# EAGLE design REG 5V (EAGLE 9.6.2)
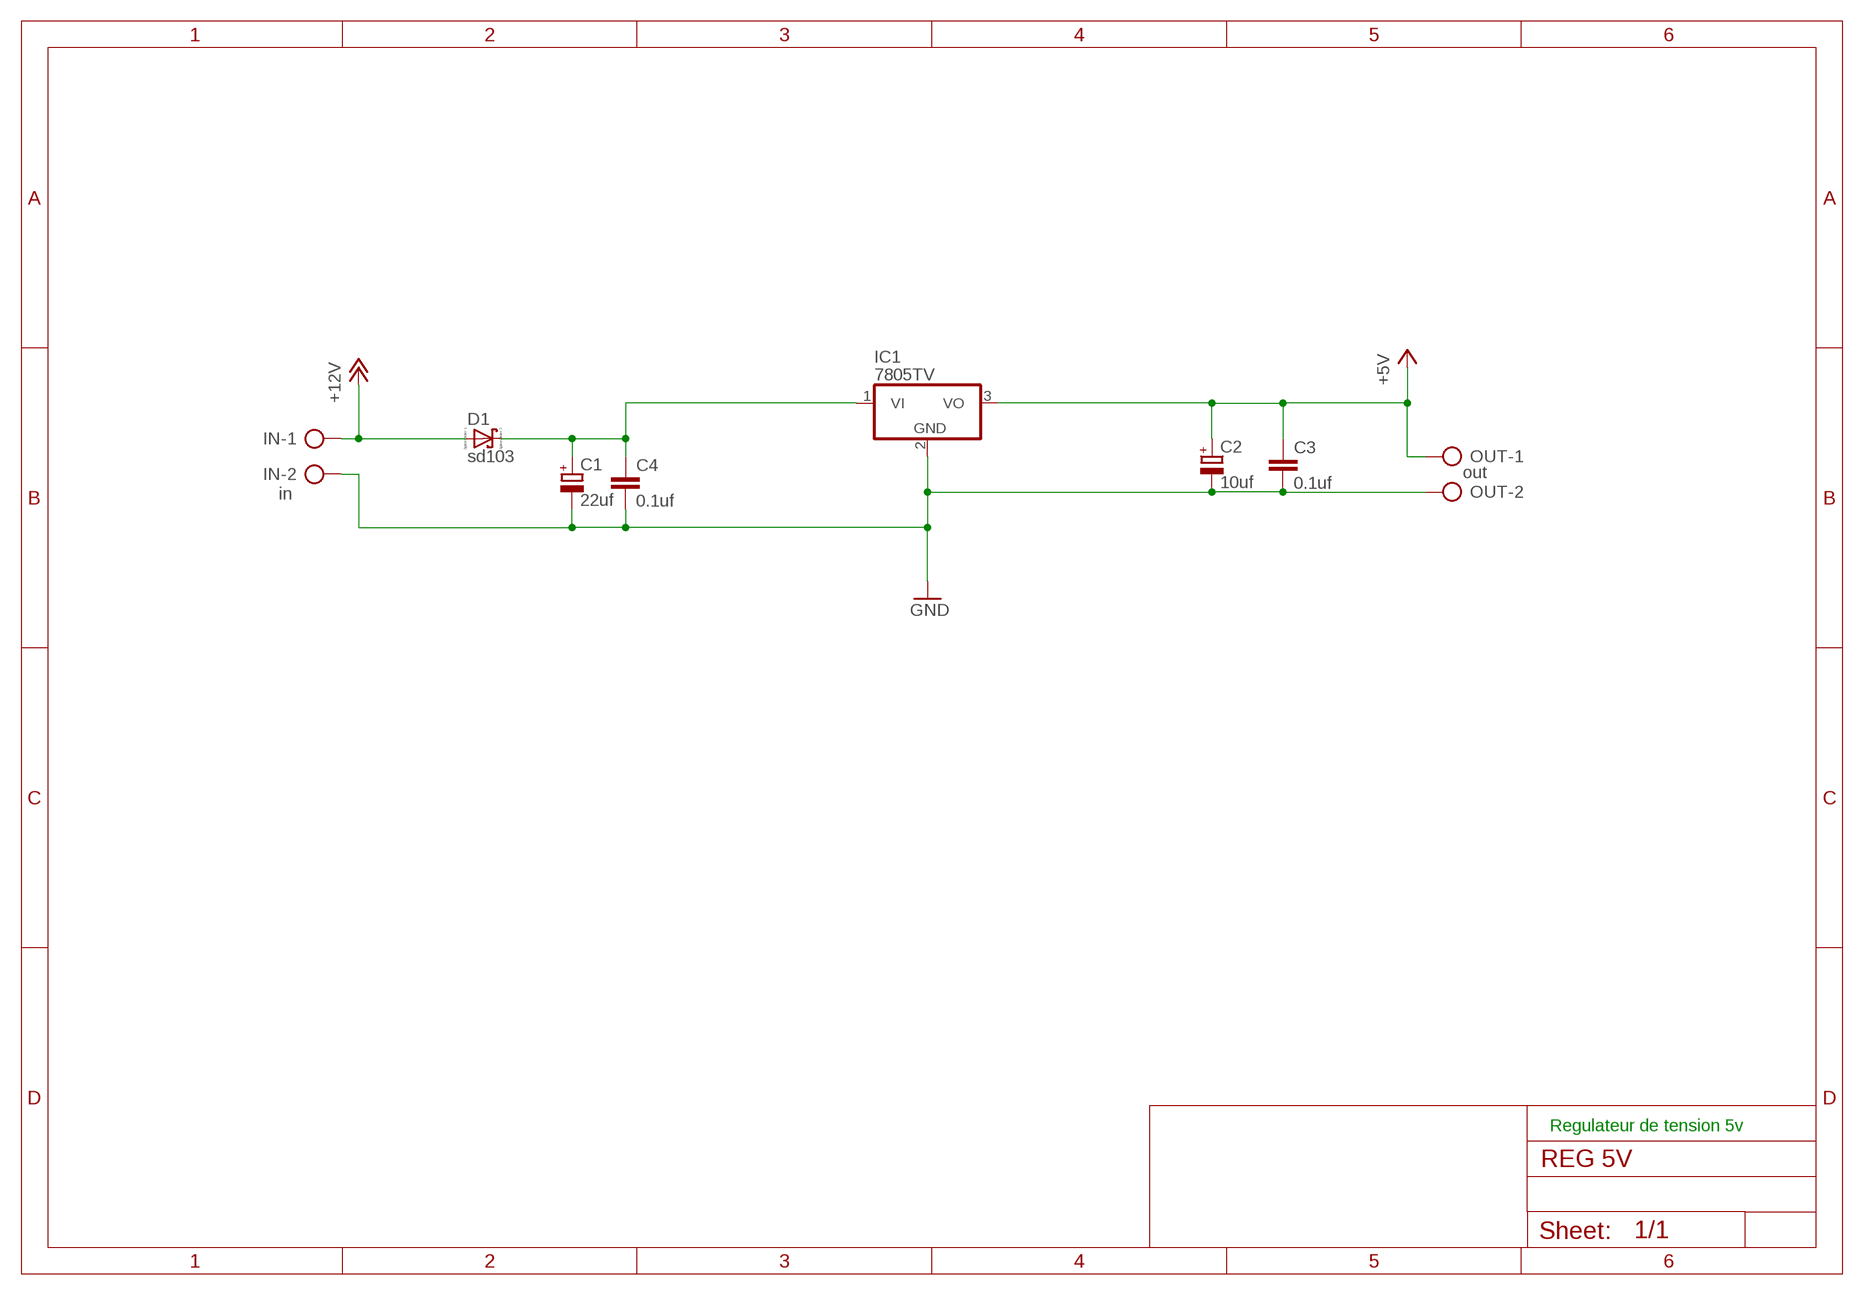
[diagram p0: schematic, sheet 1]

## Parts
C1  22uf  CPOL-EUE2.5-5  [E2,5-5]
C2  10uf  CPOL-EUE2.5-5  [E2,5-5]
C3  0.1uf  C-EU025-024X044  [C025-024X044]
C4  0.1uf  C-EU025-024X044  [C025-024X044]
D1  sd103  SCHOTTKY-DIODEDO35-7  [DIODE_DO35-7]
IC1  7805TV  [TO220V]
IN  in  AK500/2  [AK500/2]
OUT  out  AK500/2  [AK500/2]

## Nets
+5V: C2.+ C3.1 IC1.3(VO) OUT.1
+12V: D1.A(C) IN.1
GND: C1.- C2.- C3.2 C4.2 IC1.2(GND) IN.2 OUT.2
N$2: C1.+ C4.1 D1.C(A) IC1.1(VI)

## Notes on the sheet
- Regulateur de tension 5v

## Library data of the parts
C1 C2 = rcl:CPOL-EU: POLARIZED CAPACITOR, European symbol; SPICEPREFIX: C
C3 C4 = rcl:C-EU: CAPACITOR, European symbol; SPICEPREFIX: C
D1 = eagle-ltspice:SCHOTTKY-DIODE: Schottky Diode; SPICEMODEL: NONE; SPICEPREFIX: D; SPICETYPE: diode
IC1 = linear:78*: Positive VOLTAGE REGULATOR Source: http://cache.national.com/ds/LM/LM78L05.pdf http://www.fairchildsemi.com/ds/LM/LM7805.pdf
IN OUT = con-ptr500:AK500/2: CONNECTOR; OC_FARNELL: unknown; OC_NEWARK: unknown

## Board
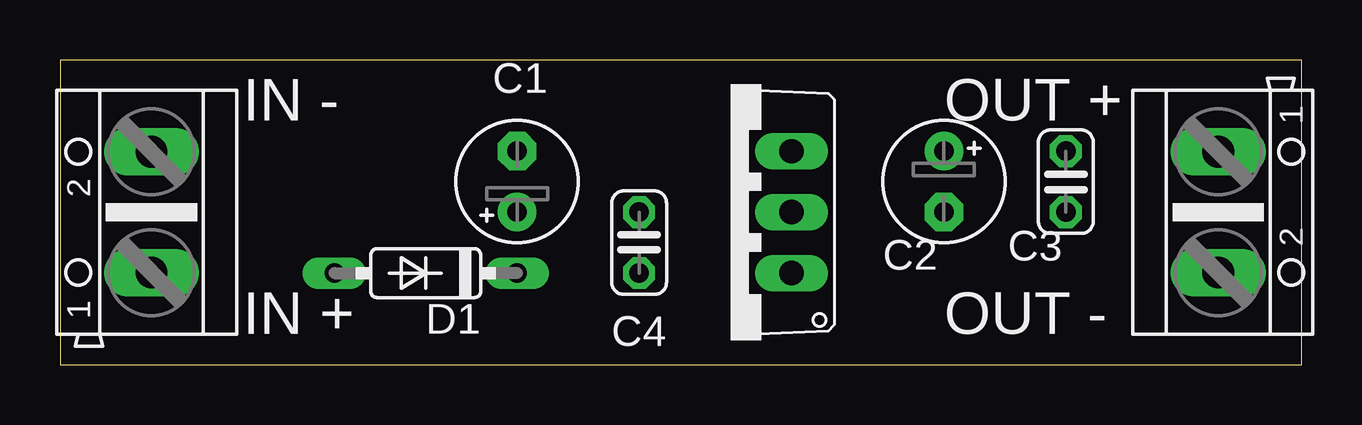
[diagram p1: board, top side]
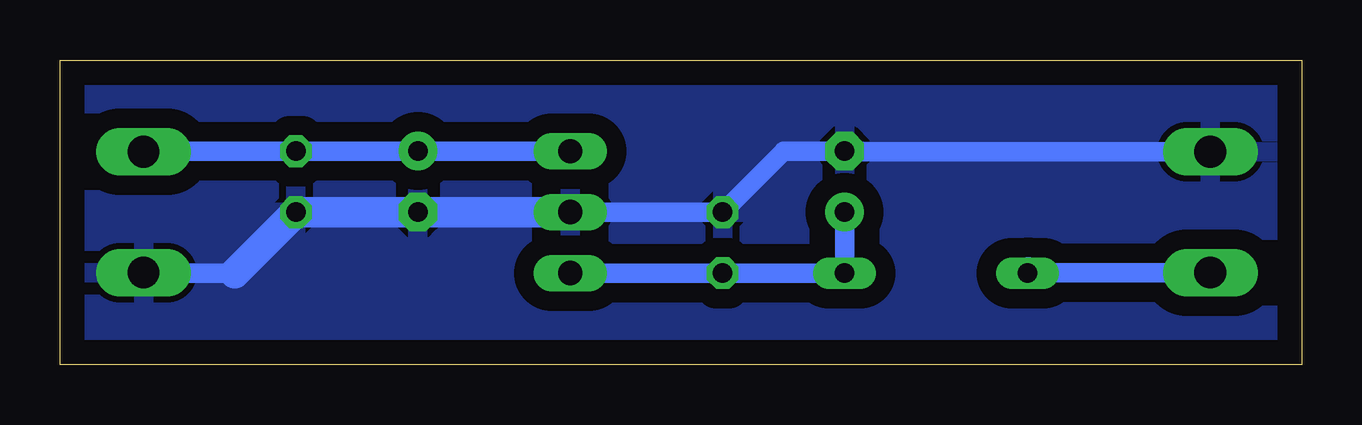
[diagram p2: board, bottom side, seen from below]

Size 51.74 x 12.69 mm. Coordinates in mm from the lower left corner, seen from the top.
Outline: 0,0 51.74,0 51.74,12.69 0,12.69 0,0
Copper layers (1*16): Top 0.035mm / dielectric 1.5mm / Bottom 0.035mm
Design rules "default": minimum track width 6mil, minimum drill 0.35mm, track to track 6mil, track to pad 6mil, pad to pad 6mil, via to via 6mil, smd to smd 6mil, copper to edge 40mil, drill to drill 6mil, minimum pad ring 10mil, minimum via ring 8mil, stop-mask expansion 4mil, vias tented up to drill 0mil, thermal gap 10mil

### Footprints (pad centres in the part's own frame; a part is rotated, then mirrored left to right if it is on the bottom)
E2,5-5 = drill 0.813 pad 1.6: + -1.27,0 | drill 0.813 pad 1.6 octagon: - 1.27,0
C025-024X044 = drill 0.813 octagon: 1 -1.27,0; 2 1.27,0
DIODE_DO35-7 = drill 0.813 long: A 3.81,0; C -3.81,0
TO220V = drill 1.016 long: 1 -2.54,-2.54; 2 0,-2.54; 3 2.54,-2.54
AK500/2 = drill 1.321 long: 1 -2.515,0; 2 2.515,0

### Placement (x,y rotation side)
C1  19.05,7.62 90 top
C2  36.83,7.62 270 top
C3  41.91,7.62 270 top
C4  24.13,5.08 90 top
D1  15.24,3.81 180 top
IC1  27.94,6.35 90 top
IN  3.81,6.35 90 top
OUT  48.26,6.35 270 top

### Tracks (layer width: path | path; a pad name or v marks a point on that pad's centre or on a via)
+5V
  Bottom 0.813: IC1.3 C2.+ C3.1 48.23,8.89
  Bottom 1.27: 48.23,8.89 OUT.1
+12V
  Bottom 0.813: 11.39,3.85 D1.A | IN.1 11.38,3.84
  Bottom 1.27: 11.38,3.84 11.39,3.85
GND
  Bottom 0.813: C1.- 21.59,8.89 C4.2 IC1.2 | 44.45,3.81 48.23,3.81 OUT.2 | 19.02,8.87 IN.2
  Bottom 1.27: IC1.2 C2.- C3.2 44.45,3.81 | C1.- 19.02,8.87
  pour Bottom (isolate 0.813): 0,12.7 52.07,12.7 52.07,0 0,0
N$2
  Bottom 0.813: C1.+ D1.C C4.1 IC1.1

### Text on the board
tPlace: IN - | OUT + | IN + | OUT -